# Altium schematic sheet PowerSupply.SchDoc: Fonte de Alimentação
size A4; SPICEModelCacheZJBQYOKP: <root> / <DocumentId>ZJBQYOKP</DocumentId> / </root>; ENG_APP_DATE: --/--/--; DSN_APP_DATE: --/--/--; CHK_APP_DATE: --/--/--; Date: *******; ApprovedBy: *******; CheckedBy: None; Author: *******; CompanyName: *******; DrawnBy: Name; Engineer: *******; Organization: *******; Address1: *******; Address2: *******; Address3: *******; Address4: *******; DocumentNumber: Doc Num; Revision: *******; SheetNumber: 3; SheetTotal: 7; CurrentTime: *******; CurrentDate: *******; Time: *******; DocumentFullPathAndName: *******; DocumentName: *******; ModifiedDate: *******; ImagePath: *******; ProjectName: *******; Application_BuildNumber: *******
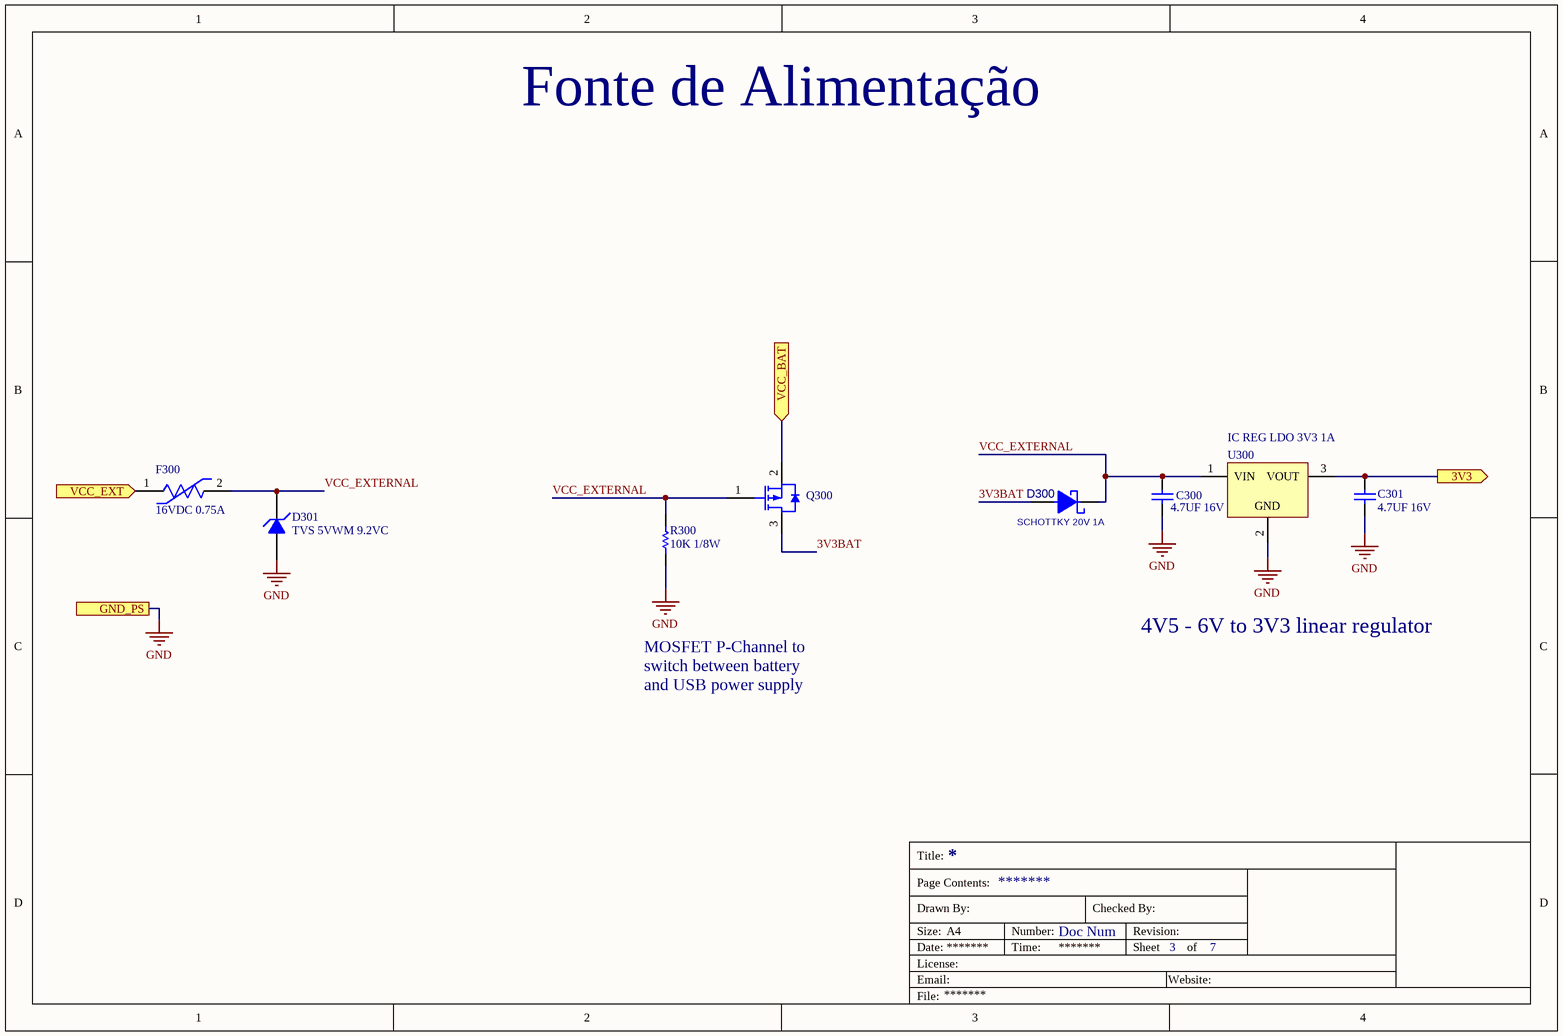
[diagram p0: PowerSupply.SchDoc]

## Parts
C300  4.7UF 16V  [CC2012-0805]
C301  4.7UF 16V  [CC2012-0805]
D300  SCHOTTKY 20V 1A  [SOD-323]
D301  TVS 5VWM 9.2VC  [DO-214AA(SMB)]
F300  16VDC 0.75A  [FP-0ZCJ0035FF2G-MFG]
Q300  IC MOSFET P_CHANNEL 20V 6A  [SOT-23]  (value not drawn)
R300  10K 1/8W  [CR2012-0805]
U300  IC REG LDO 3V3 1A  [SOT-223]

## Ports
3V3 (out), GND_PS, VCC_BAT (in), VCC_EXT (in)

## Nets
GND: C300.1 C301.1 D301.2(A) R300.1 U300.2(GND) ; port GND_PS
3V3: C301.2 U300.3(VOUT) ; port 3V3
3V3BAT: D300.A Q300.3(DRAIN)
VCC_BAT: Q300.2(SOURCE) ; port VCC_BAT
VCC_EXT: F300.1 ; port VCC_EXT
VCC_EXTERNAL: C300.2 D300.K D301.1(K) F300.2 Q300.1(GATE) R300.2 U300.1(VIN)

## Notes on the sheet
- 4V5 - 6V to 3V3 linear regulator
- MOSFET P-Channel to switch between battery and USB power supply
- Title:
- Drawn By:
- Page Contents:
- Checked By:
- Size:
- Date:
- File:
- License:
- Email:
- A4
- Number:
- Time:
- Revision:
- Sheet
- Website:
- of

## Library data of the parts
C300 C301 = CMP-004-000075-2: CAP CER 4.7UF 16V X7R 0805; Manufacturer Part Number 1: 0805F475M160NT; Manufacturer 1: FH(Guangdong Fenghua Advanced Tech); Tolerance: 10%; Radiation Hardening: No; Thickness: 0.057inch; Package Quantity: 1; REACH SVHC: No SVHC; Case Code (Imperial): 0805; Termination: SMD/SMT; Case/Package: 0805; Supplier Unit Price 1: 0,0214; Case Code (Metric): 2012; Dielectric: X7R; Ratings: AEC-Q200; Voltage Rating: 16V; Depth: 1.25mm; Length: 2mm; Source: mits.SchLib; Design Item ID: CAP CER 4.7uF 16V 20% Y5V 0805 SMD; Resistor Type: Ceramic; RoHS Compliant: Yes; Packaging: Tape and Reel; Weight: 0.000194oz; Min Operating Temperature: -55°C; Height: 1.25mm; Capacitance: 4.7uF; Voltage Rating (DC): 16V; Width: 0.049inch; Max Operating Temperature: 125°C; Series: CGA; Mount: Surface Mount; Lead Free: Lead Free
D300 = CMP-008-000014-1: DIODE SCHOTTKY 20V 1A SOD323; Manufacturer: ON Semiconductor; Manufacturer Part Number: NSR0320MW2T1G; Capacitance @ Vr, F: 29pF @ 5V, 1MHz; Speed: Fast Recovery =< 500ns, > 200mA (Io); Current - Reverse Leakage @ Vr: 50µA @ 15V; Current - Average Rectified (Io): 1A (DC); Voltage - Forward (Vf) (Max) @ If: 500mV @ 900mA; Pricing 1: 1=0.4, 10=0.298, 100=0.1689, 500=0.11188, 1000=0.08577 (USD); Design Item ID: DIODE SCHOTTKY NSR0320MW2T1G 20V 1A SOD323 SMD; Supplier Device Package: SOD-323; ComponentLink1URL: http://www.onsemi.com/pub_link/Collateral/NSR0320MW2T1-D.PDF; Packaging: Cut Tape (CT); Package / Case: SC-76, SOD-323; ComponentLink1Description: http://www.onsemi.com/pub_link/Collateral/NSR0320MW2T1-D.PDF; Reverse Recovery Time (trr): -; Voltage - DC Reverse (Vr) (Max): 20V; RoHS: RoHS Compliant; Mounting Type: Surface Mount; Diode Type: Schottky; Category: Discrete Semiconductor Products; Operating Temperature - Junction: -55°C ~ 125°C; Part Status: Active; Stock 1: 617; Source: mits.SchLib
D301 = CMP-004-00039-1: TVS DIODE 5VWM 9.2VC SMB; Element Configuration: Single; Number of Channels: 1; Test Current: 10mA; Voltage Rating (DC): 5V; Min Breakdown Voltage: 6.4V; Polarity: Unidirectional; Clamping Voltage: 9.2V; Leakage Current: 800uA; Max Surge Current: 65.3A; Max Power Dissipation: 600W; Current: 68A; Diode Type: ZENER; Power Line Protection: No; Max Breakdown Voltage: 7V; ESD Protection: Yes; Length: 4.57mm; Radiation Hardening: No; RoHS Compliant: Yes; Packaging: Cut Tape; Breakdown Voltage: 6.4V; Min Operating Temperature: -65°C; Voltage: 5V; Operating Supply Voltage: 5V; Reverse Breakdown Voltage: 6.4V; Peak Pulse Current: 65.3A; Max Operating Temperature: 150°C; Mount: Surface Mount; Number of Elements: 1; Termination: SMD/SMT; Package Quantity: 3000; Number of Unidirectional Channels: 1; Clamping Voltage-Max: 9.2V; Peak Pulse Power: 600W; Reverse Standoff Voltage: 5V; Direction: Unidirectional; Number of Pins: 2; Width: 3.94mm; Power Dissipation: 600W; Series: SMBJ; Case/Package: DO-214AA; Lead Free: Lead Free; Height: 2.237mm; Resistor Type: Zener; Max Reverse Leakage Current: 800uA; REACH SVHC: Unknown
F300 = CMP-005-00014-2: PTC Resettable Fuse 0.35A(hold) 0.75A(trip) 16VDC 40A 0.4W 0.1s 0.3Ohm SMD Solder Pad 1206 T/R Automotive; Trip Current: 750mA; Hold Current: 350mA; Time to Trip: 100ms; RoHS Compliant: Yes; Packaging: Cut Tape; Min Operating Temperature: -40°C; Mount: Surface Mount; Series: 0ZCJ; Case Code (Imperial): 1206; Case Code (Metric): 3216; Package Quantity: 1; Lead Free: Lead Free; Case/Package: 1206; Max Operating Temperature: 85°C; Max Current Rating: 40A
Q300 = IC MOSFET P_CHANNEL 20V 6A: Small Low ON Resistance MOSFET P-Channel 20V 6A 3-Pin SOT-23F T/R; Manufacturer: Toshiba; Manufacturer Part Number: SSM3J358R,LF; ComponentLink1URL: https://datasheet.ciiva.com/30023/dmp31d0u-30023794.pdf?src-supplier=Avnet; ComponentLink1Description: https://datasheet.ciiva.com/30023/dmp31d0u-30023794.pdf?src-supplier=Avnet; Supplier 1: Avnet; RoHS: No; Category: MOSFETs; Stock 1: 12000; Pricing 1: 3000=0,10175, 6000=0,09625, 12000=0,09075, 18000=0,08525, 24000=0,07975, 30000=0,07425, 300000=0,06875 (USD); Supplier 2: LCSC; Supplier Part Number 1: SSM3J358R,LF; Supplier Part Number 2: C148356
R300 = CMP-018-000030-1: RES 0805 10K Ohm 0.1% 1/10W  SMD; Manufacturer Part Number: ERJ-6ENF1002V; Manufacturer: Panasonic Electronic Components; Number of Resistors: 1; Voltage Rating (DC): 150V; Max Power Dissipation: 125mW; Temperature Coefficient: ±100ppm/°C; Tolerance: ±1%; Resistance: 10kR; Power (Watts): 0.125W, 1/8W; ComponentLink6URL: https://datasheet.ciiva.com/16725/70260748-16725031.pdf?src-supplier=Allied+Electronics; Package / Case: 0805 (2012 Metric); Supplier Device Package: 0805; Resistance (Ohms): 10k; ComponentLink14Description: https://datasheet.ciiva.com/24440/eng-ds-1773270-l-24440188.pdf?src-supplier=Onlinecomponents.com; Operating Temperature: -55°C ~ 155°C; ComponentLink15Description: https://datasheet.ciiva.com/7731/eng-ds-1773270-l-7731311.pdf?src-supplier=Element14; ComponentLink7Description: https://datasheet.ciiva.com/46372/1678782-46372714.pdf?src-supplier=Element14; ComponentLink13Description: https://datasheet.ciiva.com/16723/70063741-16723029.pdf?src-supplier=Allied+Electronics; Contact Plating: Tin; Part Status: Active; ComponentLink11Description: https://datasheet.ciiva.com/30140/aoa0000ce2-30140236.pdf?src-supplier=Onlinecomponents.com; ComponentLink6Description: https://datasheet.ciiva.com/16725/70260748-16725031.pdf?src-supplier=Allied+Electronics; Lead Free: Lead Free; ComponentLink14URL: https://datasheet.ciiva.com/24440/eng-ds-1773270-l-24440188.pdf?src-supplier=Onlinecomponents.com; Design Item ID: RES 10K OHM 1% 1/8W 0805 SMD; ComponentLink7URL: https://datasheet.ciiva.com/46372/1678782-46372714.pdf?src-supplier=Element14; ComponentLink3Description: https://datasheet.ciiva.com/16514/aoa0000ce2-16514021.pdf?src-supplier=Avnet+Asia; Category: Resistors; ComponentLink13URL: https://datasheet.ciiva.com/16723/70063741-16723029.pdf?src-supplier=Allied+Electronics; Case Code (Imperial): 0805; Failure Rate: -; Stock 1: 2392770; ComponentLink5URL: https://datasheet.ciiva.com/16759/70260748-16759350.pdf?src-supplier=Allied+Electronics; Features: Automotive AEC-Q200; ComponentLink12URL: https://datasheet.ciiva.com/24070/aoa0000ce2-24070702.pdf?src-supplier=Mouser; ComponentLink9URL: https://datasheet.ciiva.com/7830/426256-7830745.pdf?src-supplier=Element14; Termination: SMD/SMT; ComponentLink10Description: https://datasheet.ciiva.com/17212/aoa0000ce2-17212108.pdf?src-supplier=Avnet+Europe; Length: 2mm; ComponentLink15URL: https://datasheet.ciiva.com/7731/eng-ds-1773270-l-7731311.pdf?src-supplier=Element14; ComponentLink8Description: https://datasheet.ciiva.com/46372/1678782-46372715.pdf?src-supplier=Element14; ComponentLink11URL: https://datasheet.ciiva.com/30140/aoa0000ce2-30140236.pdf?src-supplier=Onlinecomponents.com; Size / Dimension: 0.079" L x 0.049" W (2.00mm x 1.25mm); ComponentLink9Description: https://datasheet.ciiva.com/7830/426256-7830745.pdf?src-supplier=Element14; REACH SVHC: No SVHC; Source: mits.SchLib; Military Standard: Not; ComponentLink5Description: https://datasheet.ciiva.com/16759/70260748-16759350.pdf?src-supplier=Allied+Electronics; ComponentLink1Description: https://industrial.panasonic.com/cdbs/www-data/pdf/RDA0000/AOA0000C283.pdf; ComponentLink16URL: https://datasheet.ciiva.com/14181/jcrn73-data-e-14181423.pdf?src-supplier=Distrelec; Stock 2: 1650; Working Voltage: 150V; ComponentLink8URL: https://datasheet.ciiva.com/46372/1678782-46372715.pdf?src-supplier=Element14; ComponentLink10URL: https://datasheet.ciiva.com/17212/aoa0000ce2-17212108.pdf?src-supplier=Avnet+Europe; Number of Pins: 2; Height: 0.6mm; ComponentLink4Description: https://datasheet.ciiva.com/27055/1988971-27055733.pdf?src-supplier=Jameco; ComponentLink4URL: https://datasheet.ciiva.com/27055/1988971-27055733.pdf?src-supplier=Jameco; Pricing 2: 1=1,68000, 10=1,48900, 100=1,13720, 1000=0,73645 (USD); Radiation Hardening: No; ComponentLink16Description: https://datasheet.ciiva.com/14181/jcrn73-data-e-14181423.pdf?src-supplier=Distrelec; Pricing 1: 1=0.1, 10=0.036, 25=0.0264, 50=0.02, 100=0.0148, 250=0.01124, 500=0.009, 1000=0.00663 (USD); ELV: Compliant; Width: 0.049inch; RoHS: RoHS Compliant; Number of Terminations: 2; ComponentLink2Description: https://datasheet.ciiva.com/11808/0900766b80f80784-11808080.pdf?src-supplier=RSComponents; Power Rating: 125mW; ComponentLink1URL: https://industrial.panasonic.com/cdbs/www-data/pdf/RDA0000/AOA0000C283.pdf; Mount: Surface Mount; Depth: 1.25mm; Case Code (Metric): 2012; ComponentLink12Description: https://datasheet.ciiva.com/24070/aoa0000ce2-24070702.pdf?src-supplier=Mouser; ComponentLink3URL: https://datasheet.ciiva.com/16514/aoa0000ce2-16514021.pdf?src-supplier=Avnet+Asia; ComponentLink2URL: https://datasheet.ciiva.com/11808/0900766b80f80784-11808080.pdf?src-supplier=RSComponents; Height - Seated (Max): 0.028" (0.70mm); Composition: Thick Film; Case/Package: 0805; Max Operating Temperature: 155°C; Packaging: Cut Tape (CT); Package Quantity: 5000; Voltage Rating: 150V; Min Operating Temperature: -55°C
U300 = IC REG LDO 3V3 1A: IC REG LDO 3.3V 1A SOT223; Manufacturer: Diodes; Manufacturer Part Number: AP2114HA-3.3TRG1; Dropout Voltage: 450mV; Number of Regulators: 1; Polarity: Positive; Quiescent Current: 90uA; Accuracy: 1.5%; Min Input Voltage: 2.5V; Max Input Voltage: 6V; Output Type: Fixed; Supplier 1: Digi-Key; RoHS: Yes; Category: Voltage Regulators - Linear; Stock 1: 1890; Pricing 1: 1=0,39000, 10=0,31700, 25=0,29000, 100=0,21570, 250=0,19552, 500=0,16180, 1000=0,12135 (USD); Mount: Surface Mount; Case/Package: TO-261-4; Number of Pins: 3; Contact Plating: Tin; Min Operating Temperature: -40°C; Max Operating Temperature: 85°C; Packaging: Tape and Reel; Package Quantity: 4000; Output Voltage: 3.3V; Output Current: 1A; Max Output Current: 1A; Number of Outputs: 1; RoHS Compliant: Yes; ComponentLink1URL: https://datasheet.ciiva.com/29568/ap2114-29568886.pdf?src-supplier=Digi-Key; ComponentLink1Description: https://datasheet.ciiva.com/29568/ap2114-29568886.pdf?src-supplier=Digi-Key; Supplier Part Number 1: AP2114HA-3.3TRG1DICT-ND